# EAGLE design ESP_CAM_VVN_v5 (EAGLE 9.6.2)
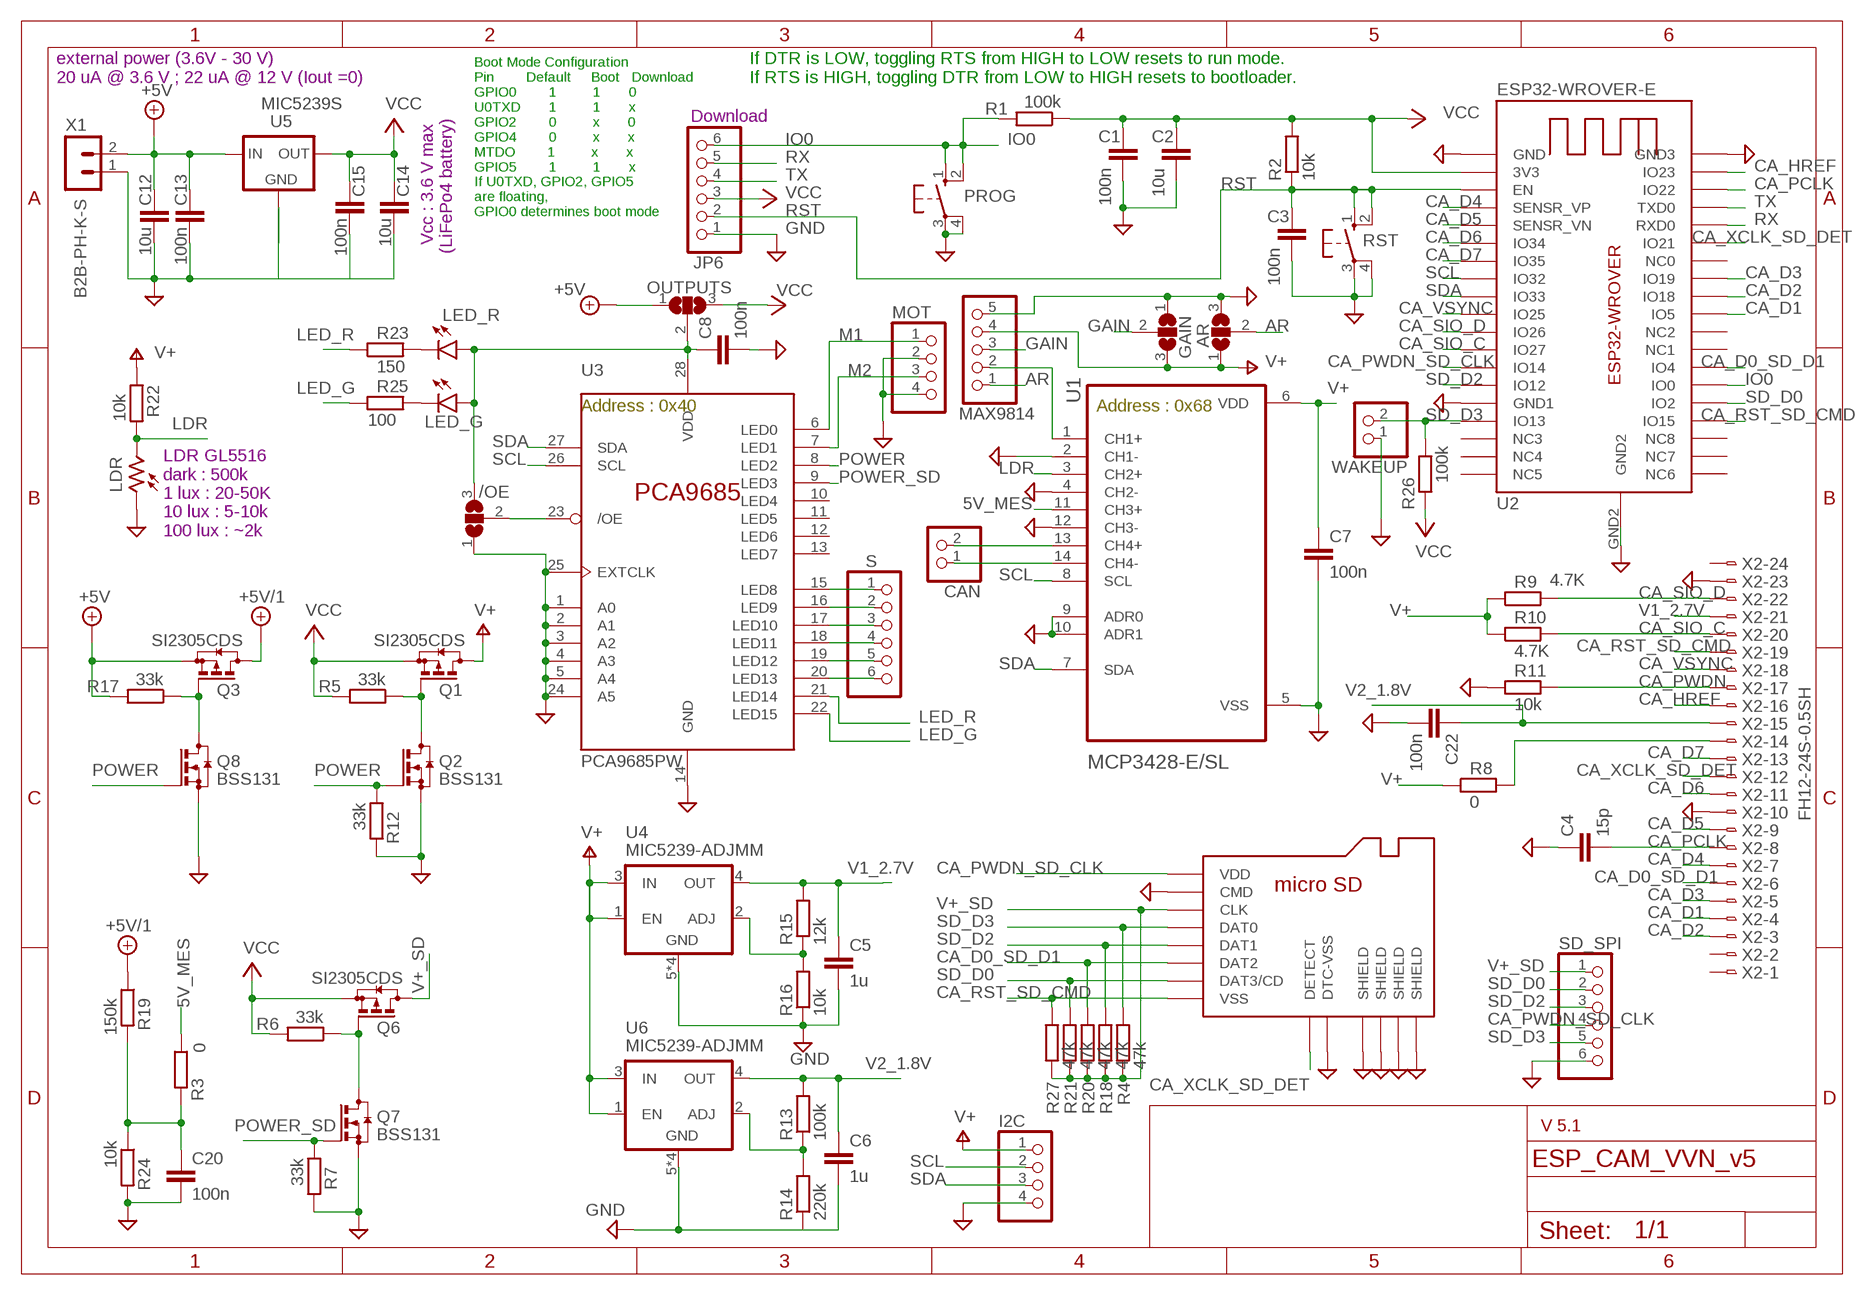
[diagram p0: schematic, sheet 1]

## Parts
/OE  SJ2W  [SJ_2]
AR  SJ2W  [SJ_2]
C1  100n  CC1206  [C1206]
C2  10u  CC1206  [C1206]
C3  100n  CC1206  [C1206]
C4  15p  CC1206  [C1206]
C5  1u  C-EUC1206  [C1206]
C6  1u  C-EUC1206  [C1206]
C7  100n  CC1206  [C1206]
C8  100n  CC1206  [C1206]
C12  10u  CC1206  [C1206]
C13  100n  CC1206  [C1206]
C14  10u  CC1206  [C1206]
C15  100n  CC1206  [C1206]
C20  100n  CC1206  [C1206]
C22  100n  CC1206  [C1206]
CAN  PINHD-1X2  [1X02]
GAIN  SJ2W  [SJ_2]
I2C  PINHD-1X4  [1X04]
JP6  PINHD-1X6/90  [1X06/90]
LDR  VT93N2  [VT900]
LED_G  LEDSMT1206  [1206]
LED_R  LEDSMT1206  [1206]
MAX9814  PINHD-1X5  [1X05]
MOT  PINHD-1X4  [1X04]
OUTPUTS  SJ2W  [SJ_2]
PROG  10-XX  [B3F-10XX]
Q1  SI2305CDS  [SOT23]
Q2  BSS131  [SOT23]
Q3  SI2305CDS  [SOT23]
Q6  SI2305CDS  [SOT23]
Q7  BSS131  [SOT23]
Q8  BSS131  [SOT23]
R1  100k  RR1206  [R1206]
R2  10k  RR1206  [R1206]
R3  0  RR1206  [R1206]
R4  47k  R-EU_R0805  [R0805]
R5  33k  RR1206  [R1206]
R6  33k  RR1206  [R1206]
R7  33k  RR1206  [R1206]
R8  0  RR1206  [R1206]
R9  4.7K  RR1206  [R1206]
R10  4.7K  RR1206  [R1206]
R11  10k  RR1206  [R1206]
R12  33k  RR1206  [R1206]
R13  100k  R-EU_R1206  [R1206]
R14  220k  R-EU_R1206  [R1206]
R15  12k  R-EU_R1206  [R1206]
R16  10k  R-EU_R1206  [R1206]
R17  33k  RR1206  [R1206]
R18  47k  R-EU_R0805  [R0805]
R19  150k  RR1206  [R1206]
R20  47k  R-EU_R0805  [R0805]
R21  47k  R-EU_R0805  [R0805]
R22  10k  RR1206  [R1206]
R23  150  RR1206  [R1206]
R24  10k  RR1206  [R1206]
R25  100  RR1206  [R1206]
R26  100k  RR1206  [R1206]
R27  47k  R-EU_R0805  [R0805]
RST  10-XX  [B3F-10XX]
S  PINHD-1X6  [1X06]
SD1  MICRO-SD-8  [MICROSDMOLEX]
SD_SPI  PINHD-1X6  [1X06]
U1  MCP3428-E/SL  [SOIC127P600X175-14N]
U2  ESP32-WROVER-E  [ESP32-WROVER]
U3  PCA9685PW  [TSSOP28]
U4  MIC5239-ADJMM  [MSOP08]
U5  MIC5239S  [SOT223]
U6  MIC5239-ADJMM  [MSOP08]
WAKEUP  PINHD-1X2  [1X02]
X1  B2B-PH-K-S  [B2B-PH-K-S]
X2  FH12-24S-0.5SH  [FH12-24S-0.5SH]

## Nets
5V_MES: R3.1 U1.11(CH3+)
+5V: C12.1 C13.1 OUTPUTS.1 Q3.2(S) R17.2 U5.1(IN) X1.2
+5V/1: Q3.3(D) R19.1
AR: AR.2 MAX9814.1
CA_D0_SD_D1: R20.2 SD1.P$1(DAT2) U2.IO4 X2.6
CA_D1: U2.IO5 X2.4
CA_D2: U2.IO18 X2.3
CA_D3: U2.IO19 X2.5
CA_D4: U2.SENSOR_VP(SENSR_VP) X2.7
CA_D5: U2.SENSOR_VN(SENSR_VN) X2.9
CA_D6: U2.IO34 X2.11
CA_D7: U2.IO35 X2.13
CA_HREF: U2.IO23 X2.16
CA_PCLK: C4.2 U2.IO22 X2.8
CA_PWDN: R11.2 X2.17
CA_PWDN_SD_CLK: SD1.P$4(VDD) SD_SPI.4 U2.IO14
CA_RST_SD_CMD: R27.2 SD1.P$6(VSS) U2.IO15 X2.19
CA_SIO_C: R10.2 U2.IO27 X2.20
CA_SIO_D: R9.2 U2.IO26 X2.22
CA_VSYNC: U2.IO25 X2.18
CA_XCLK_SD_DET: SD1.P$14(DETECT) U2.IO21 X2.12
GAIN: GAIN.2 MAX9814.3
GND: /OE.1 AR.3 C1.2 C2.2 C3.2 C4.1 C5.2 C6.2 C7.2 C8.2 C12.2 C13.2 C14.2 C15.2 C20.2 C22.2 GAIN.1 I2C.4 JP6.1 LDR.1 MAX9814.5 MOT.2 MOT.4 PROG.3(P) PROG.4(P1) Q2.2(S) Q7.2(S) Q8.2(S) R7.2 R11.1 R12.2 R14.1 R16.1 R24.2 RST.3(P) RST.4(P1) SD1.P$3(CMD) SD1.P$9(SHIELD) SD1.P$10(SHIELD) SD1.P$11(SHIELD) SD1.P$12(SHIELD) SD1.P$13(DTC-VSS) SD_SPI.6 U1.2(CH1-) U1.4(CH2-) U1.5(VSS) U1.9(ADR0) U1.10(ADR1) U1.12(CH3-) U2.GND U2.GND1 U2.GND2 U2.GND3 U3.1(A0) U3.2(A1) U3.3(A2) U3.4(A3) U3.5(A4) U3.14(GND) U3.24(A5) U3.25(EXTCLK) U4.5(GND) U4.6(GND) U4.7(GND) U4.8(GND) U5.2(GND) U5.4(GND) U6.5(GND) U6.6(GND) U6.7(GND) U6.8(GND) WAKEUP.1 X1.1 X2.10 X2.23
IO0: JP6.6 PROG.1(S) PROG.2(S1) R1.2 U2.IO0
LDR: LDR.2 R22.2 U1.3(CH2+)
LED_G: R25.1 U3.22(LED15)
LED_R: R23.1 U3.21(LED14)
M1: MOT.1 U3.6(LED0)
M2: MOT.3 U3.7(LED1)
N$1: Q1.1(G) Q2.3(D) R5.1
N$2: MAX9814.2 U1.1(CH1+)
N$3: C20.1 R3.2 R19.2 R24.1
N$4: /OE.3 C8.1 LED_G.A LED_R.A OUTPUTS.2 U3.28(VDD)
N$5: CAN.2 U1.13(CH4+)
N$6: Q6.1(G) Q7.3(D) R6.1
N$7: LED_R.C R23.2
N$8: LED_G.C R25.2
N$9: Q3.1(G) Q8.3(D) R17.1
N$10: R8.2 X2.14
N$12: CAN.1 U1.14(CH4-)
N$15: S.1 U3.15(LED8)
N$16: S.2 U3.16(LED9)
N$17: S.3 U3.17(LED10)
N$18: S.4 U3.18(LED11)
N$19: S.5 U3.19(LED12)
N$20: S.6 U3.20(LED13)
N$91: R13.1 R14.2 U6.2(ADJ)
N$92: R15.1 R16.2 U4.2(ADJ)
OE: /OE.2 U3.23(/OE)
POWER: Q2.1(G) Q8.1(G) R12.1 U3.8(LED2)
POWER_SD: Q7.1(G) R7.1 U3.9(LED3)
RST: C3.1 JP6.2 R2.1 RST.1(S) RST.2(S1) U2.EN
RX: JP6.5 U2.RXD0
SCL: I2C.2 U1.8(SCL) U2.IO32 U3.26(SCL)
SD_D0: R21.2 SD1.P$2(DAT3/CD) SD_SPI.2 U2.IO2
SD_D2: R18.2 SD1.P$8(DAT1) SD_SPI.3 U2.IO12
SD_D3: R4.2 R26.2 SD1.P$7(DAT0) SD_SPI.5 U2.IO13 WAKEUP.2
SDA: I2C.3 U1.7(SDA) U2.IO33 U3.27(SDA)
TX: JP6.4 U2.TXD0
V1_2.7V: C5.1 R15.2 U4.4(OUT) X2.21
V2_1.8V: C6.1 C22.1 R13.2 U6.4(OUT) X2.15
V+: AR.1 C7.1 GAIN.3 I2C.1 MAX9814.4 Q1.3(D) R8.1 R9.1 R10.1 R22.1 U1.6(VDD) U4.1(EN) U4.3(IN) U6.1(EN) U6.3(IN)
V+_SD: Q6.3(D) R4.1 R18.1 R20.1 R21.1 R27.1 SD1.P$5(CLK) SD_SPI.1
VCC: C1.1 C2.1 C14.1 C15.1 JP6.3 OUTPUTS.3 Q1.2(S) Q6.2(S) R1.1 R2.2 R5.2 R6.2 R26.1 U2.VDD33(3V3) U5.3(OUT)
Unconnected: U2.CLK(NC3) U2.CMD(NC4) U2.NC0 U2.NC1 U2.NC2 U2.SD0(NC5) U2.SD1(NC6) U2.SD2(NC7) U2.SD3(NC8) U3.10(LED4) U3.11(LED5) U3.12(LED6) U3.13(LED7) X2.1 X2.2 X2.24

## Notes on the sheet
- external power (3.6V - 30 V)
  20 uA @ 3.6 V ; 22 uA @ 12 V (Iout =0)
- If DTR is LOW, toggling RTS from HIGH to LOW resets to run mode.
  If RTS is HIGH, toggling DTR from LOW to HIGH resets to bootloader.
- Download
- Vcc : 3.6 V max 
  (LiFePo4 battery)
- Boot Mode Configuration
  Pin        Default     Boot   Download
  GPIO0        1         1       0
  U0TXD       1         1       x
  GPIO2        0         x       0
  GPIO4        0         x       x
  MTDO        1         x       x
  GPIO5        1         1       x
  If U0TXD, GPIO2, GPIO5 
  are floating, 
  GPIO0 determines boot mode
- Address : 0x40 | Address : 0x68
- LDR GL5516
  dark : 500k
  1 lux : 20-50K
  10 lux : 5-10k
  100 lux : ~2k
- V 5.1

## Library data of the parts
/OE AR GAIN OUTPUTS = jumper:SJ2W: SMD solder JUMPER
C1-C4 C7 C8 C12-C15 C20 C22 = eagle-ltspice:C: CAPACITOR, European symbol; SPICEMODEL: NONE; SPICEPREFIX: C
C5 C6 = rcl:C-EU: CAPACITOR, European symbol; SPICEPREFIX: C
CAN WAKEUP = pinhead:PINHD-1X2: PIN HEADER
I2C MOT = pinhead:PINHD-1X4: PIN HEADER
JP6 S SD_SPI = pinhead:PINHD-1X6: PIN HEADER
LDR = photo-elements:VT9: Photoconductive Cell VT900 Series Source: http://optoelectronics.perkinelmer.com/content/Datasheets/DTS_vt900seriesdatasheet.pdf
LED_G LED_R = led:LED: LED OSRAM: - CHIPLED LG R971, LG N971, LY N971, LG Q971, LY Q971, LO R971, LY R971 LH N974, LH R974 LS Q976, LO Q976, LY Q976 LO Q996 - Hyper CHIPLED LW Q18S LB Q993, LB Q99A, LB R99A - SideLED LS A670, LO A670, LY A670, LG A670, LP A670 LB A673, LV A673, LT A673, LW A673 LH A674 LY A675 LS A676, LA A676, LO A676, LY A676, LW A676 LS A679, LY A679, LG A679 - Hyper Micro SIDELED® LS Y876, LA Y876, LO Y876, LY Y876 LT Y87S - SmartLED LW L88C, LW L88S LB L89C, LB L89S, LG L890 LS L89K, LO L89K, LY L89K LS L896, LA L896, LO L896, LY L896 - TOPLED LS T670, LO T670, LY T670, LG T670, LP T670 LSG T670, LSP T670, LSY T670, LOP T670, LYG T670 LG T671, LOG T671, LSG T671 LB T673, LV T673, LT T673, LW T673 LH T674 LS T676, LA T676, LO T676, LY T676, LB T676, LH T676, LSB T676, LW T676 LB T67C, LV T67C, LT T67C, LS T67K, LO T67K, LY T67K, LW E67C LS E67B, LA E67B, LO E67B, LY E67B, LB E67C, LV E67C, LT E67C LW T67C LS T679, LY T679, LG T679 LS T770, LO T770, LY T770, LG T770, LP T770 LB T773, LV T773, LT T773, LW T773 LH T774 LS E675, LA E675, LY E675, LS T675 LS T776, LA T776, LO T776, LY T776, LB T776 LHGB T686 LT T68C, LB T68C - Hyper Mini TOPLED® LB M676 - Mini TOPLED Santana® LG M470 LS M47K, LO M47K, LY M47K Source: http://www.osram.convergy.de LUXEON: - LUMILED® LXK2-PW12-R00, LXK2-PW12-S00, LXK2-PW14-U00, LXK2-PW14-V00 LXK2-PM12-R00, LXK2-PM12-S00, LXK2-PM14-U00 LXK2-PE12-Q00, LXK2-PE12-R00, LXK2-PE12-S00, LXK2-PE14-T00, LXK2-PE14-U00 LXK2-PB12-K00, LXK2-PB12-L00, LXK2-PB12-M00, LXK2-PB14-N00, LXK2-PB14-P00, LXK2-PB14-Q00 LXK2-PR12-L00, LXK2-PR12-M00, LXK2-PR14-Q00, LXK2-PR14-R00 LXK2-PD12-Q00, LXK2-PD12-R00, LXK2-PD12-S00 LXK2-PH12-R00, LXK2-PH12-S00 LXK2-PL12-P00, LXK2-PL12-Q00, LXK2-PL12-R00 Source: www.luxeon.com KINGBRIGHT: KA-3528ASYC Source: www.kingbright.com
MAX9814 = pinhead:PINHD-1X5: PIN HEADER
PROG RST = switch-omron:10-XX: OMRON SWITCH; MPN: B3F-1000; OC_FARNELL: 176432; OC_NEWARK: 36M3542
Q1 Q3 Q6 = transistor-small-signal-perso:SI2305CDS: P-CHANNEL MOS FET
Q2 Q7 Q8 = transistor-small-signal-perso:BSS131: N-CHANNEL MOS FET
R1-R3 R5-R12 R17 R19 R22-R26 = eagle-ltspice:R: RESISTOR, European symbol; SPICEMODEL: NONE; SPICEPREFIX: R
R4 R13-R16 R18 R20 R21 R27 = rcl:R-EU_: RESISTOR, European symbol; SPICEPREFIX: R
SD1 = micro-sd_cp:MICRO-SD-8: Connecteur de carte mémoire microSD de Molex - Séries 503398 et 504077
U1 = MCP3428-E_SL:MCP3428-E/SL: Check prices <https://pricing.snapeda.com/parts/MCP3428-E/SL/Microchip/view-part?ref=eda>; AVAILABILITY: In Stock; DESCRIPTION: 16 Bit Analog to Digital Converter 4 Input 1 Sigma-Delta 14-SOIC; MF: Microchip; MP: MCP3428-E/SL; PACKAGE: SOIC-14 Microchip; PRICE: None; PURCHASE-URL: https://pricing.snapeda.com/search/part/MCP3428-E/SL/?ref=eda
U2 = 32teeth - ESP32-WROVER:ESP32-WROVER-E: ESP32-WROVER-E
U3 = i2c-led-controller:PCA9685
U4 U6 = micrel:MIC5239-ADJ: LDO REGULATOR
U5 = micrel:MIC5239S: LDO REGULATOR
X1 = con-JST PH:B2B-PH: JST PH series header 2.00mm pitch disconnectable crimp style connectors, vertical (side entry type), 2 pins
X2 = con-hirose:FH12-24S-0.5S: 0.5mm Pitch Connectors For FPC/FFC Source: Data sheet <http://www.hirose.co.jp/cataloge_hp/e58605370.pdf>; MPN: FH12-24S-0.5SH(55); OC_FARNELL: 1324552; OC_NEWARK: 34M6170

## Board
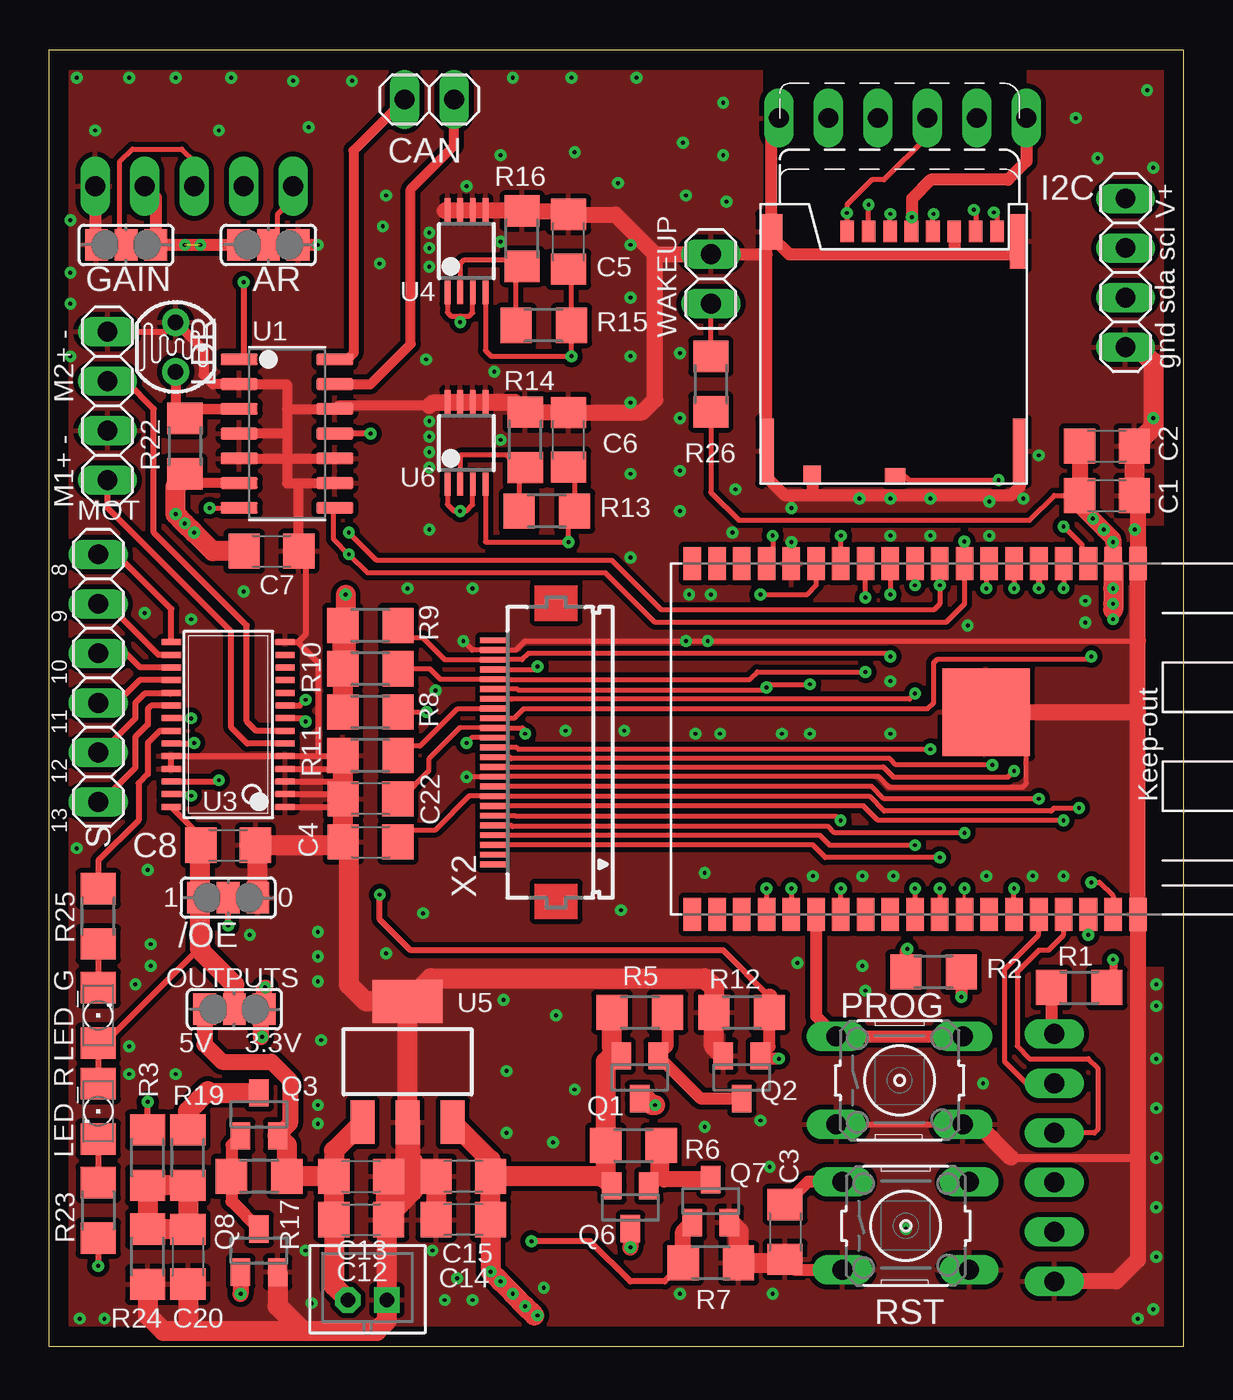
[diagram p1: board, top side]
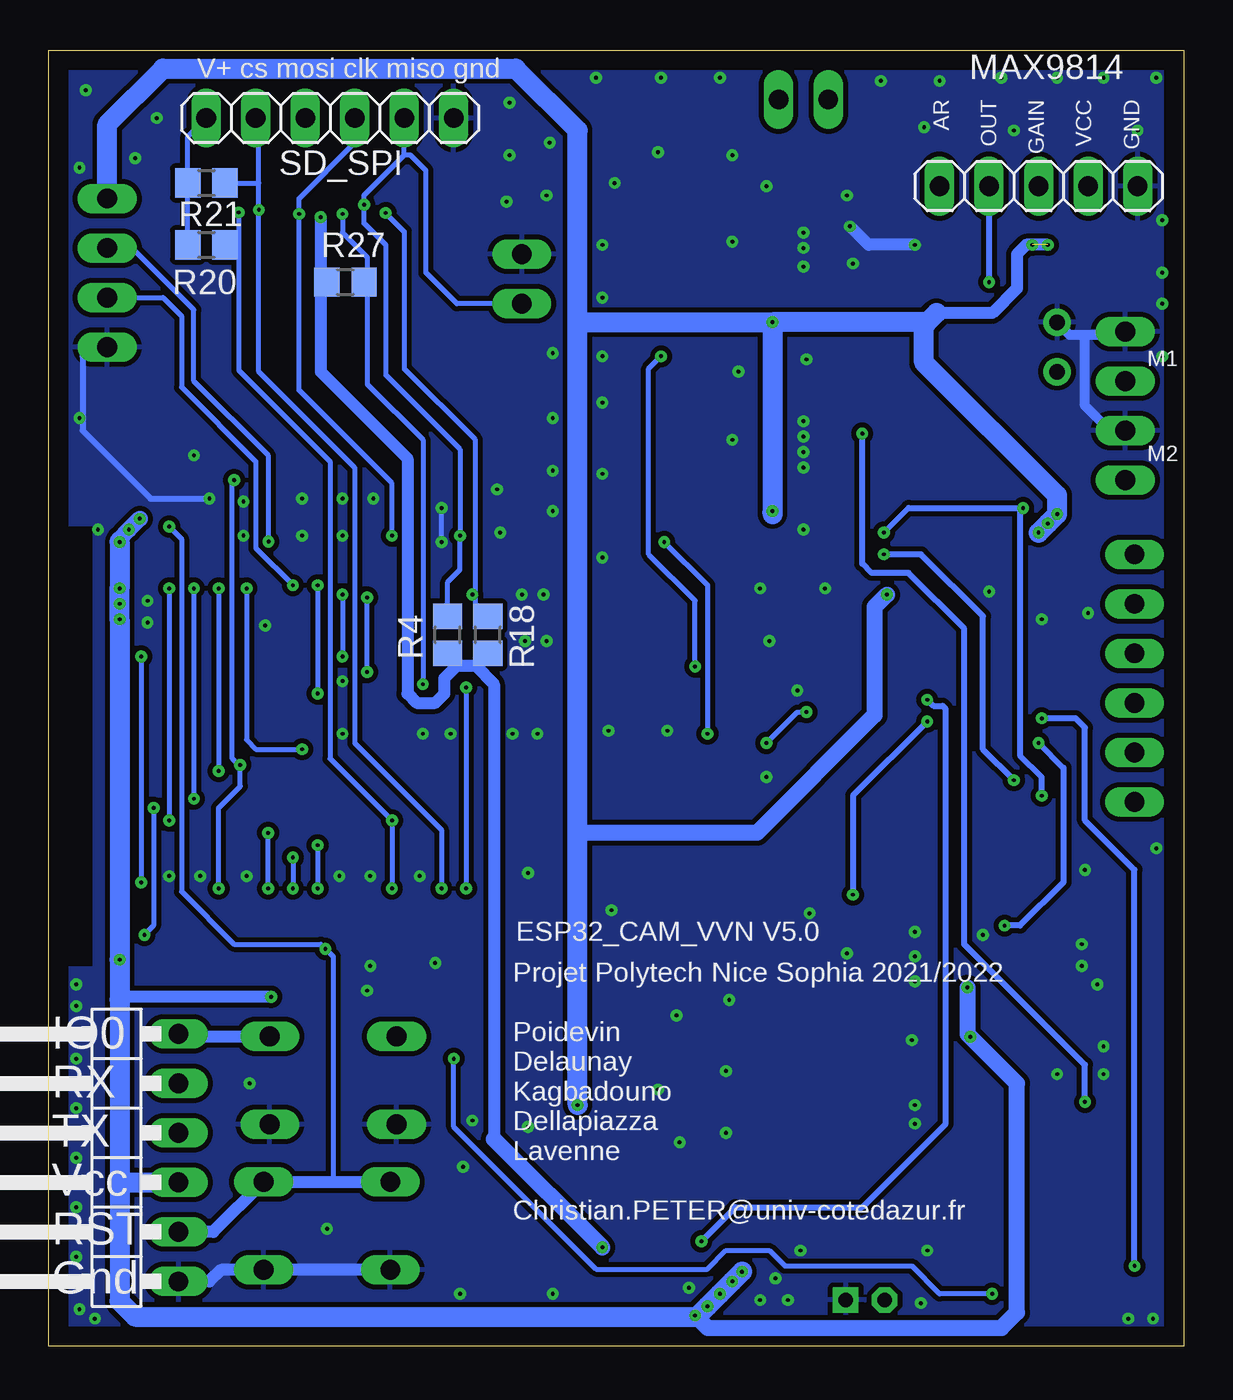
[diagram p2: board, bottom side, seen from below]

Size 58.25 x 66.51 mm. Coordinates in mm from the lower left corner, seen from the top.
Outline: 0,0 58.25,0 58.25,66.51 0,66.51 0,0
Copper layers (1*16): Top 0.035mm / dielectric 1.5mm / Bottom 0.035mm
Design rules "default *": minimum track width 6mil, minimum drill 0.2mm, track to track 6mil, track to pad 6mil, pad to pad 6mil, via to via 6mil, smd to smd 6mil, copper to edge 40mil, drill to drill 6mil, minimum pad ring 10mil, minimum via ring 8mil, stop-mask expansion 4mil, vias tented up to drill 0mil, thermal gap 10mil

### Footprints (pad centres in the part's own frame; a part is rotated, then mirrored left to right if it is on the bottom)
SJ_2 = smd 1.168 x 1.6: 1 -1.524,0; 2 0,0; 3 1.524,0
C1206 = smd 1.6 x 1.8: 1 -1.4,0; 2 1.4,0
1X02 = drill 1.016 long: 1 -1.27,0; 2 1.27,0
1X04 = drill 1.016 long: 1 -3.81,0; 2 -1.27,0; 3 1.27,0; 4 3.81,0
1X06/90 = drill 1.016 long: 1 -6.35,-3.81; 2 -3.81,-3.81; 3 -1.27,-3.81; 4 1.27,-3.81; 5 3.81,-3.81; 6 6.35,-3.81
VT900 = drill 0.8 pad 1.4: 1 -1.27,0; 2 1.27,0
1206 = smd 1.6 x 1.803: A -1.422,0; C 1.422,0
1X05 = drill 1.016 long: 1 -5.08,0; 2 -2.54,0; 3 0,0; 4 2.54,0; 5 5.08,0
B3F-10XX = drill 1.016 long: 1 -3.251,2.261; 2 3.251,2.261; 3 -3.251,-2.261; 4 3.251,-2.261
SOT23 = smd 1 x 1.4: 1 -0.95,-1.1; 2 0.95,-1.1; 3 0,1.1
R1206 = smd 1.6 x 1.803: 1 -1.422,0; 2 1.422,0
R0805 = smd 1.3 x 1.5: 1 -0.95,0; 2 0.95,0
1X06 = drill 1.016 long: 1 -6.35,0; 2 -3.81,0; 3 -1.27,0; 4 1.27,0; 5 3.81,0; 6 6.35,0
MICROSDMOLEX = smd 0.7 x 1.1: P$1 12.15,-0.9; P$2 11.05,-0.9; P$3 9.95,-0.9; P$4 8.85,-0.9; P$5 7.75,-0.9; P$6 6.65,-0.9; P$7 5.55,-0.9; P$8 4.45,-0.9 | smd 1.14 x 1.83: P$9 0.57,-0.915 | smd 0.7 x 3.33: P$10 0.35,-12.165; P$11 13.31,-12.165 | smd 0.86 x 2.8: P$12 13.23,-1.4 | smd 0.9 x 0.93: P$13 2.66,-13.365 | smd 1.05 x 0.78: P$14 6.925,-13.44
SOIC127P600X175-14N = smd 1.9 x 0.6: 1 -2.455,3.81; 2 -2.455,2.54; 3 -2.455,1.27; 4 -2.455,0; 5 -2.455,-1.27; 6 -2.455,-2.54; 7 -2.455,-3.81; 8 2.455,-3.81; 9 2.455,-2.54; 10 2.455,-1.27; 11 2.455,0; 12 2.455,1.27; 13 2.455,2.54; 14 2.455,3.81
ESP32-WROVER = smd 1.7 x 0.9: CLK 18,1.27; CMD 0,1.27; EN 0,21.59; GND 0,24.13; GND1 0,6.35; GND3 18,24.13; IO0 18,7.62; IO2 18,6.35; IO4 18,8.89; IO5 18,12.7; IO12 0,7.62; IO13 0,5.08; IO14 0,8.89; IO15 18,5.08; IO18 18,13.97; IO19 18,15.24; IO21 18,17.78; IO22 18,21.59; IO23 18,22.86; IO25 0,12.7; IO26 0,11.43; IO27 0,10.16; IO32 0,15.24; IO33 0,13.97; IO34 0,17.78; IO35 0,16.51; NC0 18,16.51; NC1 18,10.16; NC2 18,11.43; RXD0 18,19.05; SD0 18,2.54; SD1 18,3.81; SD2 0,3.81; SD3 0,2.54; SENSOR_VN 0,19.05; SENSOR_VP 0,20.32; TXD0 18,20.32; VDD33 0,22.86 | smd 4.5 x 4.5: GND2 7.62,16.34
TSSOP28 = smd 0.305 x 0.991: 1 -4.225,-2.918; 2 -3.575,-2.918; 3 -2.925,-2.918; 4 -2.275,-2.918; 5 -1.625,-2.918; 6 -0.975,-2.918; 7 -0.325,-2.918; 8 0.325,-2.918; 9 0.975,-2.918; 10 1.625,-2.918; 11 2.275,-2.918; 12 2.925,-2.918; 13 3.575,-2.918; 14 4.225,-2.918; 15 4.225,2.918; 16 3.575,2.918; 17 2.925,2.918; 18 2.275,2.918; 19 1.625,2.918; 20 0.975,2.918; 21 0.325,2.918; 22 -0.325,2.918; 23 -0.975,2.918; 24 -1.625,2.918; 25 -2.275,2.918; 26 -2.925,2.918; 27 -3.575,2.918; 28 -4.225,2.918
MSOP08 = smd 0.3 x 1.2: 1 -0.976,-2.113; 2 -0.326,-2.113; 3 0.324,-2.113; 4 0.974,-2.113; 5 0.974,2.112; 6 0.324,2.112; 7 -0.326,2.112; 8 -0.976,2.112
SOT223 = smd 1.219 x 2.235: 1 -2.311,-3.099; 2 0,-3.099; 3 2.311,-3.099 | smd 3.6 x 2.2: 4 0,3.099
B2B-PH-K-S = drill 0.75 pad 1.3 square: 1 1,0 | drill 0.75 pad 1.3 octagon: 2 -1,0
FH12-24S-0.5SH = smd 0.3 x 1.3: 1 -5.75,3.25; 2 -5.25,3.25; 3 -4.75,3.25; 4 -4.25,3.25; 5 -3.75,3.25; 6 -3.25,3.25; 7 -2.75,3.25; 8 -2.25,3.25; 9 -1.75,3.25; 10 -1.25,3.25; 11 -0.75,3.25; 12 -0.25,3.25; 13 0.25,3.25; 14 0.75,3.25; 15 1.25,3.25; 16 1.75,3.25; 17 2.25,3.25; 18 2.75,3.25; 19 3.25,3.25; 20 3.75,3.25; 21 4.25,3.25; 22 4.75,3.25; 23 5.25,3.25; 24 5.75,3.25

### Placement (x,y rotation side)
/OE  9.21,23.02 180 top
AR  11.27,56.52 0 top
C1  54.29,43.66 0 top
C2  54.29,46.2 0 top
C3  37.78,5.87 270 top
C4  16.51,25.88 0 top
C5  26.67,56.67 90 top
C6  26.67,46.51 90 top
C7  11.43,40.8 0 top
C8  9.21,25.72 0 top
C12  16.03,6.51 0 top
C13  16.03,8.73 0 top
C14  21.27,6.51 180 top
C15  21.27,8.73 180 top
C20  7.14,4.6 270 top
C22  16.51,28.1 180 top
CAN  19.53,63.98 0 top
GAIN  3.97,56.52 0 top
I2C  55.24,55.09 270 top
JP6  55.4,9.68 90 bottom
LDR  6.51,51.28 270 top
LED_G  2.54,16.99 90 top
LED_R  2.54,12.06 270 top
MAX9814  7.46,59.53 0 bottom
MOT  3.02,48.26 90 top
OUTPUTS  9.53,17.3 0 top
PROG  43.66,13.65 0 top
Q1  30.32,13.81 180 top
Q2  35.56,13.81 180 top
Q3  10.79,11.91 0 top
Q6  29.84,7.14 180 top
Q7  33.97,7.46 0 top
Q8  10.79,4.92 0 top
R1  52.86,18.41 180 top
R2  45.4,19.21 0 top
R3  5.08,9.68 270 top
R4  37.78,36.51 90 bottom
R5  30.32,17.14 180 top
R6  30,10.32 180 top
R7  33.97,4.29 0 top
R8  16.51,32.54 0 top
R9  16.51,36.99 0 top
R10  16.51,34.77 0 top
R11  16.51,30.32 0 top
R12  35.56,17.14 180 top
R13  25.56,42.86 0 top
R14  24.45,46.51 270 top
R15  25.4,52.39 0 top
R16  24.29,56.83 270 top
R17  10.79,8.73 0 top
R18  35.72,36.51 90 bottom
R19  7.14,9.68 270 top
R20  50.16,56.52 0 bottom
R21  50.16,59.69 0 bottom
R22  6.99,46.2 90 top
R23  2.54,6.99 90 top
R24  5.08,4.6 270 top
R25  2.54,22.07 270 top
R26  33.97,49.37 90 top
R27  43.02,54.61 0 bottom
RST  43.97,6.19 0 top
S  2.54,34.29 270 top
SD1  36.51,58.1 0 top
SD_SPI  43.81,63.02 0 bottom
U1  12.22,46.83 0 top
U2  31.75,40.16 270 top
U3  9.21,31.91 90 top
U4  21.43,56.2 0 top
U5  18.41,14.61 0 top
U6  21.43,46.35 0 top
WAKEUP  33.97,54.77 270 top
X1  16.35,2.38 0 top
X2  26.04,30.48 90 top

### Tracks (layer width: path | path; a pad name or v marks a point on that pad's centre or on a via)
5V_MES  (via drill 0.2)
  Top 0.305: v16.51,46.83 U1.11 | R3.1 v5.08,12.54
  Bottom 0.305: v5.08,12.54 5.08,14.45 11.27,20.64 11.27,36.83 14.13,39.69 16.03,39.69 16.51,40.16 v16.51,46.83
+5V
  Top 0.813: OUTPUTS.1 8,15.49 8.89,14.61 11.43,14.61 12.38,13.65 12.38,11.44 Q3.2
  Top 1.016: U5.1 14.63,10.04 C13.1 | C13.1 C12.1 14.63,3.1 X1.2 | C13.1 R17.2 12.22,10.33 Q3.2
+5V/1
  Top 1.016: Q3.3 8.26,13.01 8.16,13.1 7.14,12.09 R19.1
AR
  Top 0.254: AR.2 11.75,56.99 11.75,58.1 12.54,58.9 MAX9814.1
CA_D0_SD_D1  (via drill 0.2)
  Top 0.254: 40.48,27.14 v40.63,26.98 v40.64,26.99 40.41,27.22 23.96,27.22 23.95,27.23 X2.6 | U2.IO4 v40.64,23.5 | SD1.P$1 48.66,58.18 48.58,58.26 v48.5,58.18
  Bottom 0.254: v40.64,23.5 v40.63,23.5 v40.63,26.98 43.81,30.16 43.81,45.4 48.5,50.09 48.5,56.52 | v48.5,58.18 48.5,56.52 | R20.2 48.5,56.52
CA_D1  (via drill 0.2)
  Top 0.254: v44.45,23.5 U2.IO5 | v44.45,25.72 40.06,25.72 39.55,26.23 X2.4
  Bottom 0.254: v44.45,25.72 v44.45,23.5
CA_D2  (via drill 0.2)
  Top 0.254: v45.72,25.08 39.85,25.08 39.2,25.73 X2.3 | v45.72,23.5 U2.IO18
  Bottom 0.254: v45.72,25.08 v45.72,23.5
CA_D3  (via drill 0.2)
  Top 0.152: U2.IO19 v46.99,23.5
  Top 0.254: v46.99,26.35 40.32,26.35 40.01,26.67 23.79,26.67 23.73,26.73 X2.5
  Bottom 0.254: v46.99,23.5 v46.99,26.35
CA_D4  (via drill 0.2)
  Top 0.254: U2.SENSOR_VP v52.07,38.89 | v52.07,26.99 42.55,26.99 41.8,27.73 X2.7
  Bottom 0.254: v52.07,38.89 v52.07,26.99
CA_D5  (via drill 0.2)
  Top 0.254: v50.8,28.1 42.86,28.1 42.23,28.73 X2.9
  Top 0.305: U2.SENSOR_VN v50.8,38.89
  Bottom 0.254: v50.8,38.89 v50.8,28.1
CA_D6  (via drill 0.2)
  Top 0.254: v49.53,29.53 49.21,29.21 43.34,29.21 42.82,29.73 X2.11 | U2.IO34 v49.53,38.89
  Bottom 0.254: v49.53,38.89 v49.53,29.53
CA_D7  (via drill 0.2)
  Top 0.254: U2.IO35 48.1,40.01 v48.1,38.89 | X2.13 24.02,30.72 24.1,30.64 v45.24,30.64
  Bottom 0.254: v48.1,38.89 48.1,31.11 47.62,30.64 v45.24,30.64
CA_HREF  (via drill 0.2)
  Top 0.254: v53.5,35.4 53.34,35.24 45.56,35.24 45.4,35.08 45.4,33.02 45.09,32.71 24.37,32.71 23.9,32.23 X2.16 | v53.5,23.81 53.91,23.81 54.61,23.12 U2.IO23
  Bottom 0.254: v53.5,35.4 v53.5,23.81
CA_PCLK  (via drill 0.2)
  Top 0.254: U2.IO22 v53.34,21.11 | v52.86,27.62 51.59,27.62 51.44,27.46 42.86,27.46 42.1,28.23 X2.8 22.76,28.26 21.59,28.26 19.84,26.51 18.55,26.51 C4.2
  Bottom 0.254: v53.34,21.11 52.86,21.59 v52.86,27.62
CA_PWDN
  Top 0.254: R11.2 18.41,30.8 19.05,30.8 20.95,32.7 22.76,32.7 X2.17
CA_PWDN_SD_CLK  (via drill 0.2)
  Top 0.254: U2.IO14 v40.64,41.59 | SD1.P$4 45.36,58.06 v45.4,58.1
  Bottom 0.254: v40.64,41.59 40.64,44.29 45.4,49.05 v45.4,58.1 45.4,58.9 42.55,61.75 SD_SPI.4
CA_RST_SD_CMD  (via drill 0.2)
  Top 0.254: v36.83,23.5 U2.IO15 | v39.05,33.97 36.99,33.97 v36.83,33.81 36.67,33.66 24.11,33.66 24.05,33.72 22.8,33.72 X2.19 | SD1.P$6 43.16,58.09 v43.18,58.1
  Bottom 0.254: v36.83,33.81 v36.83,23.5 | v43.18,58.1 43.18,57.15 41.91,55.88 41.91,54.77 | 41.91,54.77 41.91,49.37 39.05,46.51 v39.05,33.97 | R27.2 41.91,54.77
CA_SIO_C  (via drill 0.2)
  Top 0.254: v41.91,38.42 U2.IO27 | v41.91,34.61 36.35,34.61 36.04,34.29 35.98,34.23 X2.20 20.09,34.23 19.56,34.77 R10.2
  Bottom 0.254: v41.91,34.61 v41.91,38.42
CA_SIO_D  (via drill 0.2)
  Top 0.254: R9.2 18.57,36.35 19.21,36.35 20.33,35.23 X2.22 22.8,35.24 24.29,35.24 24.61,35.56 43.02,35.56 v43.18,35.4 | U2.IO26 v43.18,38.58
  Bottom 0.254: v43.18,38.58 v43.18,35.4
CA_VSYNC  (via drill 0.2)
  Top 0.254: U2.IO25 v44.45,39.05 | X2.18 23.75,33.23 23.77,33.21 44.17,33.21 v44.45,33.5
  Bottom 0.254: v44.45,39.05 v44.45,33.5
CA_XCLK_SD_DET  (via drill 0.2)
  Top 0.254: v48.42,29.84 43.47,29.84 43.15,30.16 23.73,30.16 23.66,30.23 X2.12 | U2.IO21 v49.53,23.5 | SD1.P$14 43.92,44.66 44.13,44.45 v48.74,44.45
  Top 0.305: v48.42,29.84
  Bottom 0.254: v49.53,23.5 49.53,27.62 48.42,28.73 v48.42,29.84 48.51,29.84 48.84,30.17 48.84,44.34 v48.74,44.45
GAIN
  Top 0.254: GAIN.2 3.65,56.83 3.65,60.8 4.29,61.44 6.83,61.44 7.46,60.8 MAX9814.3
GND  (via drill 0.2)
  Top 0.254: U2.GND2 48.26,32.54 50.16,30.64 50.16,28.89 49.96,28.68 43.13,28.68 42.59,29.23 X2.10 22.77,29.21 v21.43,29.21 | 55.88,36.2 24.45,36.2 23.98,35.73 X2.23 21.74,35.73 v21.27,36.2 | U2.GND1 v38.1,41.27 | v38.1,43.02 38.1,43.66 | SD1.P$9 37.08,56.95
  Top 0.305: U3.4 15,29.63 15.11,29.53 | 13.81,30.28 U3.5 U3.24 U3.25 | 13.81,30.28 15.1,30.28 15.11,30.3 | U3.3 15.02,28.98 15.11,28.89 | U3.2 14.88,28.33 C22.2 14.7,27.68 U3.1 | C7.2 13.18,40.45 13.18,36.51 12.8,36.13 U3.14 12.76,36.13 13.81,35.08 13.81,30.28 | SD1.P$12 49.85,56.6 49.85,56.2 | v50.01,43.5 49.61,43.89 | MOT.4 6.03,52.07 LDR.1 | PROG.3 PROG.4
  Top 0.406: 49.37,9.68 55.88,9.68
  Top 0.508: 12.22,48.1 12.22,49.37 U1.2 8.41,49.37 7.94,49.85 7.94,51.12 LDR.1 | 12.22,48.1 12.22,46.83 | 12.22,46.83 U1.4 | U1.5 12.22,45.56 | 12.22,45.56 U1.10 | 12.22,46.83 12.22,45.56 | 12.22,45.56 12.22,44.29 12.86,44.29 | 12.22,48.1 U1.12 14.84,48.26 19.53,48.26 24.12,48.26 R14.1 | 12.86,44.29 U1.9 | C7.2 12.83,44.26 12.86,44.29
  Top 0.61: SD1.P$11 49.82,44.11 49.61,43.89 49.37,43.66 39.21,43.66 | 39.21,43.66 38.1,43.66 37.78,43.66 36.86,44.58 SD1.P$10 36.83,45.97 36.83,56.04 | SD1.P$13 39.17,43.7 39.21,43.66 | C3.2 38.33,3.93 RST.3 | 37.08,56.95 37.99,56.04 46.35,56.04 | 46.35,56.04 49.68,56.04 49.74,56.1 SD1.P$12 | SD1.P$3 46.46,56.14 46.35,56.04 | 36.83,56.04 36.83,56.94 | WAKEUP.1 36.83,56.04 | SD1.P$9 37.08,62.64 SD_SPI.6 | AR.3 v13.81,56.52 | MAX9814.5 2.38,56.58 GAIN.1
  Top 0.813: 55.88,32.54 U2.GND3 55.88,9.68 55.88,4.45 54.77,3.33 JP6.1 | 55.88,32.54 55.88,36.2 U2.GND 55.88,43.5 55.72,43.66 C1.2 | 55.88,32.54 U2.GND2 48.09,31.6 | PROG.4 47.66,11.39 49.37,9.68 | 31.11,56.04 29.08,58.07 C5.2 26.49,58.26 R16.1 24.23,58.31 U4.5 U4.6 U4.7 U4.8 20.37,58.31 20.32,58.26 | 31.11,56.04 WAKEUP.1 | 31.11,56.04 31.11,48.58 30.45,47.91 C6.2 26.65,47.94 R14.1 23.92,48.47 U6.5 U6.6 U6.7 U6.8 20.41,48.42 19.68,48.42 19.53,48.26
  Top 1.016: I2C.4 55.88,51.28 56.67,50.48 56.67,47.18 C2.2 C1.2 | Q2.2 34.14,15.38 R12.2 34.14,18.41 33.66,18.89 19.6,18.89 U5.4 | C13.2 C15.2 C14.2 | 17.35,6.43 X1.1 17.35,1.32 16.83,0.79 13.02,0.79 | 17.35,6.43 17.35,6.83 | 17.35,6.43 C12.2 | U5.2 U5.4 | Q8.2 11.74,2.07 13.02,0.79 | C4.1 15.4,25.59 15.4,18.57 16.27,17.7 U5.4 | C4.1 C22.2 15.11,28.89 15.11,29.53 15.11,30.3 R11.1 | R24.2 5.08,1.59 5.87,0.79 7.14,0.79 | 7.14,0.79 13.02,0.79 | C20.2 7.14,0.79 | /OE.1 10.73,25.59 C8.2 14.95,25.72 C4.1 | Q7.2 35.4,5.89 R7.2 37.59,4.29 C3.2
  Top 1.27: C12.2 C13.2 | U5.2 18.41,9.6 18.57,9.44 18.57,8.05 17.35,6.83
  Bottom 0.254: v38.1,41.27 v38.1,43.02
  Bottom 0.305: I2C.4 56.04,51.28 56.52,50.8 56.52,46.99 53.02,43.5 v50.01,43.5
  Bottom 0.508: MOT.4 3.17,51.91 5.08,51.91 | LDR.1 5.87,51.91 5.08,51.91 | MOT.2 3.81,46.99 5.08,48.26 5.08,51.91
  Bottom 0.61: RST.3 RST.4 49.41,3.93 50.01,3.33 JP6.1 | v13.81,56.52 16.19,56.52 v17.14,57.47
  other vias: 53.18,38.26 53.18,37.15 47.15,36.99 43.18,34.13 55.72,41.91 50.8,45.72 56.67,47.62 56.83,18.57 56.83,17.46 56.67,1.91 55.88,1.43 56.83,4.6 56.83,7.14 56.83,9.68 56.83,12.22 56.83,14.76 21.75,2.38 20.32,2.38 2.86,1.43 1.59,1.43 4.45,18.57 5.24,19.53 5.24,20.64 13.81,18.73 13.81,20 13.81,21.27 33.66,24.29 39.21,24.13 41.75,24.13 43.34,24.13 48.1,24.13 50.48,24.13 52.07,24.13 43.18,31.43 39.05,31.43 34.45,31.43 33.18,31.43 32.38,42.86 32.38,44.93 21.43,59.53 17.3,59.05 1.11,55.09 1.11,53.5 1.11,50.8 16.99,55.56 19.37,50.64 22.86,50.01 19.53,41.91 10,38.73 4.92,37.62 5.08,24.45 1.43,25.56 38.42,19.68 41.75,19.53 41.91,18.26 47.94,13.49 43.97,6.03 13.81,12.38 13.81,11.43 23.5,10.95 23.5,14.13 23.34,17.78 6.51,13.97 33.66,11.27 36.51,11.59 36.99,9.21 37.15,2.7 32.38,2.7 25.4,3.02 20.95,3.49 4.13,13.97 4.13,15.4 10.32,21.11 19.84,33.66 32.7,36.2 33.81,36.2 33.97,38.58 32.86,38.58 29.84,40.48 29.84,44.77 29.84,48.42 29.84,50.8 29.84,53.82 29.84,56.52 19.53,57.15 19.53,56.36 19.53,55.4 23.18,56.67 19.53,47.47 19.53,46.67 19.53,45.88 19.53,45.09 23.18,46.51 37.62,31.43 19.68,4.92 13.18,4.92 13.49,2.22 1.43,65.09 4.13,65.09 6.51,65.09 9.37,65.09 12.54,64.93 15.56,64.93 23.81,65.09 26.83,65.09 30.16,65.09 34.61,63.82 34.61,61.12 34.77,58.74 32.7,59.05 29.21,59.69 26.99,61.28 23.18,61.12 13.34,62.55 8.73,62.39 2.38,62.39 1.11,57.78 7.3,37.31 18.41,38.89 21.75,38.89 26.51,31.59 29.53,31.59 29.37,22.38 19.21,22.23 17.3,20.16 13.97,15.72 26.04,16.99 26.99,13.18 25.88,10.48 56.36,64.45 56.67,60.48 53.82,60.96 52.7,63.02 43.18,41.59 43.18,43.5 41.59,43.5 48.26,43.34 48.26,41.59 45.24,41.59 45.24,43.5 35.24,43.97 35.08,41.75 32.38,50.96 32.38,47.62 32.54,61.75
  pour Top (isolate 0.254): 0,0 0,66.52 36.51,66.52 36.51,43.97 50.32,43.97 50.32,66.52 58.26,66.52 58.26,42.23 55.88,42.23 55.88,19.37 58.26,19.37 58.26,0
  pour Bottom (isolate 0.254): 0,0 0,66.52 58.26,66.52 58.26,42.23 55.88,42.23 55.88,19.37 58.26,19.37 58.26,0
IO0
  Top 0.61: R1.2 51.44,16.19 JP6.6 | PROG.2 PROG.1 39.37,16.95 U2.IO0
  Bottom 0.61: JP6.6 51.47,15.91 PROG.2
LDR
  Top 0.508: LDR.2 6.51,48.26 6.67,48.1 U1.3 7.47,48.1 R22.2
LED_G
  Top 0.305: U3.22 5.72,31.58 5.71,31.59 5.08,30.96 5.08,29.37 4.6,28.89 4.6,26.99 2.54,24.92 R25.1
LED_R  (via drill 0.2)
  Top 0.305: R23.1 v2.54,4.13 | v7.3,32.23 U3.21
  Bottom 0.305: v2.54,4.13 2.54,24.45 5.08,26.99 5.08,31.75 5.56,32.23 v7.3,32.23
M1
  Top 0.305: U3.6 10.18,30.93 9.37,31.75 9.37,36.67 3.02,43.02 MOT.1
M2
  Top 0.305: U3.7 10.64,31.58 10.16,32.07 10.16,36.99 5.4,41.75 5.4,48.1 3.97,49.53 MOT.3
N$1
  Top 0.61: R5.1 31.74,15.38 Q1.1 33.47,12.71 Q2.3
N$2  (via drill 0.2)
  Top 0.305: v10,54.61 10,50.87 U1.1
  Bottom 0.305: MAX9814.2 v10,54.61
N$3
  Top 1.016: R19.2 C20.1 7.12,6.03 R24.1 R3.2 R19.2
N$4
  Top 0.305: LED_R.A LED_G.A 2.86,15.56 7.78,20.48 | U3.28 7.78,26.2 7.78,25.69 7.78,23.11 /OE.3 | C8.1 7.81,23.05 7.78,23.02
  Top 1.016: OUTPUTS.2 9.53,18.57 7.78,20.32 7.78,20.48 7.78,23.02 7.78,25.69 C8.1
N$5
  Top 0.508: U1.13 16.51,49.37 18.57,51.44 18.57,59.37 20.8,61.59 CAN.2
N$6
  Top 0.813: Q7.3 31.59,8.56 31.43,8.73 R6.1 31.27,10.16 31.27,8.72 Q6.1
N$7
  Top 0.305: LED_R.C R23.2
N$8
  Top 0.305: R25.2 LED_G.C
N$9
  Top 0.61: Q3.1 9.37,10.33 R17.1 9.37,7.44 Q8.3
N$10  (via drill 0.2)
  Top 0.254: R8.2 19.05,32.54 19.21,32.54 v19.38,32.54 | X2.14 21.7,31.23 v21.43,30.96
  Bottom 0.254: v21.43,30.96 19.84,32.54 v19.38,32.54
N$12
  Top 0.508: CAN.1 15.63,61.35 15.63,50.96 15.31,50.64 U1.14
N$15
  Top 0.305: U3.15 6.29,37.84 3.49,40.64 S.1
N$16
  Top 0.305: U3.16 5.63,35.48 3.02,38.1 S.2
N$17
  Top 0.305: S.3 3.97,35.56 4.7,34.83 U3.17
N$18
  Top 0.305: U3.18 4.66,34.18 3.49,33.02 S.4
N$19
  Top 0.305: U3.19 6.25,33.5 4.92,33.5 4.45,33.02 4.45,32.23 2.7,30.48 S.5
N$20
  Top 0.305: U3.20 5.26,32.88 5.08,32.7 5.08,31.91 4.45,31.27 4.45,29.69 2.7,27.94 S.6
N$91
  Top 0.254: U6.2 21.11,45.71 21.11,45.72 23.5,45.72 24.12,45.09 R14.2 24.14,44.78 R13.1
N$92
  Top 0.254: R15.1 23.98,55.1 R16.2 23.97,55.72 21.27,55.72 21.11,55.55 U4.2
OE  (via drill 0.2)
  Top 0.305: U3.23 7.44,30.93 v7.46,30.96 | v9.21,21.59 /OE.2
  Bottom 0.305: v7.46,30.96 6.19,29.69 6.19,23.81 8.41,21.59 v9.21,21.59
POWER  (via drill 0.2)
  Top 0.305: U3.8 13.01,32.23 v13.18,32.07 | v16.99,23.18 16.99,21.91 18.57,20.32 34.61,20.32 36.98,17.95
  Top 0.61: R12.1 36.98,15.38 Q2.1 36.66,14.76 v37.47,14.76
  Top 0.813: Q8.1 v9.85,2.7 v9.84,2.7 | R12.1 36.98,17.95
  Bottom 0.254: v9.84,2.7 12.54,2.7 13.97,4.13 20.48,4.13 21.27,4.92 23.5,4.92 24.45,3.97 30.16,3.97 37.47,11.27 v37.47,14.76
  Bottom 0.305: v13.18,32.07 16.99,28.26 v16.99,23.18
POWER_SD  (via drill 0.2)
  Top 0.305: U3.9 12.88,32.88 v13.18,33.18 | R7.1 31.6,3.33 29.84,3.33 27.78,5.4 v24.77,5.4
  Top 0.813: Q7.1 32.55,5.89 R7.1
  Bottom 0.305: v24.77,5.4 23.02,7.14 16.51,7.14 12.22,11.43 12.22,32.7 12.38,32.86 12.86,32.86 v13.18,33.18
RST  (via drill 0.2)
  Top 0.254: U2.EN 53.02,40.48 53.02,41.12 v52.07,42.07
  Top 0.61: RST.1 38.96,8.45 C3.1 | R2.1 43.98,20.33 v44.05,20.4
  Bottom 0.254: v52.07,42.07 51.44,41.43 51.44,23.34 48.74,20.64 44.29,20.64 v44.05,20.4 43.66,20 43.66,8.45
  Bottom 0.61: RST.1 43.66,8.45 RST.2 49.8,5.87 JP6.2
RX
  Top 0.254: JP6.5 50.16,13.49 49.05,14.61 49.05,19.37 50.8,21.11 U2.RXD0
SCL  (via drill 0.2)
  Top 0.254: v46.98,41.29 46.99,41.27 U2.IO32 46.99,38.1 46.04,37.15 31.11,37.15 28.57,39.69 16.35,39.69 v15.4,40.64 14.61,41.43 14.61,42.95 U1.8
  Top 0.305: U3.26 8.66,28.98 v8.73,29.05
  Bottom 0.254: v46.98,41.29 46.98,45.7 50.8,49.53 50.8,53.18 53.98,56.36 I2C.2
  Bottom 0.305: v8.73,29.05 10.32,30.64 10.32,37.47 13.49,40.64 v15.4,40.64
SD_D0  (via drill 0.2)
  Top 0.254: v38.1,23.5 U2.IO2 | v47.47,58.31 47.56,58.22 SD1.P$2
  Bottom 0.254: v38.1,23.5 38.1,26.51 42.55,30.96 42.55,45.09 47.47,50.01 v47.47,58.31 47.47,59.69 | 47.47,59.69 47.47,62.87 SD_SPI.2 | R21.2 47.47,59.69
SD_D2  (via drill 0.2)
  Top 0.254: v36.51,38.58 38.89,38.58 39.37,39.05 U2.IO12 | SD1.P$8 v40.96,58.15 v40.96,58.16 40.96,58.58 42.23,59.85 42.86,59.85 45.09,62.07 SD_SPI.3
  Bottom 0.254: v36.51,38.58 36.35,38.73 | 36.35,38.73 36.35,46.51 40.01,50.16 40.01,57.2 v40.96,58.16 | R18.2 36.35,38.1 36.35,38.73
SD_D3  (via drill 0.2)
  Top 0.254: v37.15,41.59 37.15,40.48 U2.IO13 | SD1.P$7 v42.06,58.57 v42.07,58.58 | R26.2 WAKEUP.2
  Bottom 0.254: 40.01,61.12 42.07,59.05 v42.07,58.58 42.07,57.63 40.96,56.52 40.96,49.85 37.15,46.04 v37.15,41.59 37.15,39.85 37.78,39.21 R4.2 | 40.01,61.12 SD_SPI.5 | WAKEUP.2 37.31,53.5 38.89,55.09 38.89,60.33 39.69,61.12 40.01,61.12
SDA  (via drill 0.2)
  Top 0.254: v45.72,39.05 U2.IO33 45.72,38.1 45.4,37.78 31.43,37.78 28.89,40.32 16.83,40.32 v15.4,41.75 | v8.26,43.02 U1.7
  Top 0.305: v7.3,28.26 7.23,28.33 U3.27
  Bottom 0.254: I2C.3 52.39,53.82 51.44,52.86 51.44,49.21 47.62,45.4 47.62,40.96 v45.72,39.05 | v15.4,41.75 14.13,43.02
  Bottom 0.305: 7.14,28.26 v7.3,28.26 7.3,29.21 8.41,30.32 8.41,42.86 v8.26,43.02 14.13,43.02
TX
  Top 0.254: JP6.4 53.66,10.95 53.82,11.11 53.82,14.29 53.34,14.76 50.32,14.76 49.69,15.4 49.69,19.21 50.8,20.32 51.28,20.32 52.07,21.11 U2.TXD0
V1_2.7V  (via drill 0.2)
  Top 0.254: U4.4 22.41,51.1 22.7,50.8 v26.83,50.8 R15.2 26.82,55.12 C5.1 | X2.21 25.05,34.73 25.08,34.77 25.08,34.84 v25.08,34.88
  Bottom 0.254: v25.08,34.88 25.08,38.26 27.46,40.64 27.46,50.16 v26.83,50.8
V2_1.8V  (via drill 0.2)
  Top 0.254: U6.4 22.41,41.27 v26.67,41.27 26.67,42.55 R13.2 26.98,44.8 C6.1 | C22.1 18.07,28.1 19.5,29.53 19.5,30.13 21.11,31.75 22.65,31.73 X2.15 24.31,31.73 24.45,31.59 v24.45,31.43
  Bottom 0.254: v26.67,41.27 24.45,39.05 v24.45,31.43
V+  (via drill 0.2)  (1 unrouted)
  Top 0.254: U4.1 20.46,53.05 20.64,52.86 21.11,52.86 | 21.11,52.86 21.59,52.86 21.76,53.03 U4.3 | U6.1 20.46,43.2 20.8,42.86 v21.11,42.86 21.43,42.86 21.76,43.19 U6.3 | 21.11,52.86 v21.11,52.55
  Top 0.508: U1.6 7.47,44.29 | 7.47,44.29 6.67,44.29 | 7.47,44.29 R22.1
  Top 0.61: AR.1 v6.99,56.52 GAIN.3 5.49,58.96 MAX9814.4
  Top 1.016: Q1.3 30.63,12.71 30.96,12.38 v31.11,12.38 | v15.24,38.58 15.24,34.92 R10.1 | R10.1 R9.1 | C7.1 8.41,40.8 v7.46,41.75 v6.99,42.23 v6.51,42.7 6.51,44.13 6.67,44.29 | R10.1 R8.1
  Bottom 0.61: v6.99,56.52 8.1,56.52 8.57,56.04 8.57,54.29 9.84,53.02 12.7,53.02
  Bottom 0.813: v15.24,38.58 15.88,37.94 15.88,32.38 21.91,26.35 31.11,26.35
  Bottom 1.016: I2C.1 55.24,62.71 52.39,65.56 34.29,65.56 31.11,62.39 31.11,52.55 | v31.11,12.38 31.11,26.35 31.11,52.55 | 31.11,52.55 v21.11,52.55 | v21.11,52.55 v21.11,42.86 21.11,42.7 | 12.7,53.02 13.18,52.55 | 13.18,52.55 13.34,52.39 13.34,50.48 6.51,43.66 v6.51,42.7 v6.99,42.23 v7.46,41.75 | 13.18,52.55 v21.11,52.55
  other vias: 7.78,56.52
V+_SD  (via drill 0.2)
  Top 0.254: SD1.P$5 44.29,57.23 v44.29,57.94
  Top 0.61: SD_SPI.1 50.16,60.8 49.21,59.85 45.24,59.85 44.29,58.9 44.29,57.23
  Top 0.813: Q6.3 v29.84,5.08
  Bottom 0.254: R27.1 44.29,54.61 | R4.1 37.78,35.4 37.31,34.92 | R18.1 36.35,34.92 | R20.1 R21.1 51.12,62.07 SD_SPI.1
  Bottom 0.61: v44.29,57.94 44.29,54.61 44.29,50.01 39.85,45.56 39.85,33.5 39.37,33.02 38.42,33.02 37.94,33.5 37.94,34.29 37.31,34.92 36.35,34.92 35.4,33.97 35.4,10.64
  Bottom 0.813: 35.4,10.64 v29.84,5.08
VCC  (via drill 0.2)
  Top 0.254: R26.1 33.97,43.81 35.4,42.39 50.32,42.39 51.59,43.66 C1.1 | v10.95,15.88 10.89,15.88
  Top 0.305: v25.08,1.59 24.92,1.59
  Top 0.406: R1.1 54.61,18.74 v54.61,19.84
  Top 0.508: 52.89,46.55 C2.1
  Top 0.61: R2.2 v46.83,17.95 v46.83,17.94
  Top 0.813: C2.1 C1.1 52.89,43.15 v53.58,42.47 v54.13,41.91 54.61,41.43 v54.61,41.27 U2.VDD33 | OUTPUTS.3 11.05,18.35 v11.11,18.41 | 10.89,15.88 10.89,16.92
  Top 1.016: U2.VDD33 v54.61,38.89 v54.61,38.1 54.61,37.78 | 28.88,14.91 28.58,14.61 R6.2 28.58,8.56 Q6.2 28.41,8.73 C15.1 | 28.9,14.93 28.88,14.91 | 28.88,14.91 Q1.2 28.9,15.38 R5.2 | C15.1 C14.1 v22.67,3.84 v23.18,3.33 v23.81,2.7 v24.45,2.06 24.92,1.59 | C15.1 22.67,9.56 U5.3
  Bottom 0.61: v46.83,17.94 54.45,17.94 54.61,17.78
  Bottom 0.813: v54.61,41.27 54.61,41.43 v54.13,41.91 v53.58,42.47 | v25.08,1.59 24.45,0.95 9.37,0.95 8.57,1.75 8.57,13.49 v10.95,15.88 11.11,16.03 v11.11,18.41
  Bottom 1.016: 54.61,8.41 JP6.3 | v54.61,41.27 v54.61,38.89 v54.61,37.31 v54.61,19.84 54.61,17.78 54.61,8.41 | 54.61,8.41 54.61,2.32 53.82,1.52 24.99,1.52 v24.45,2.06 v23.81,2.7 v23.18,3.33 v22.67,3.84

### Text on the board
tNames: gnd sda scl V+ | M2+ - | M1+ - | 8 | 9 | 10 | 11 | 12 | 13 | 1 | 0 | 5V 3.3V
bNames: V+ cs mosi clk miso gnd | AR / / OUT / / GAIN / / VCC / / GND | M1 / / / / M2 | ESP32_CAM_VVN V5.0 | Projet Polytech Nice Sophia 2021/2022 / / Poidevin / Delaunay / Kagbadouno / Dellapiazza / Lavenne / / Christian.PETER@univ-cotedazur.fr | IO0 / RX / TX / Vcc / RST / Gnd